# Altium schematic sheet Schem1_pwr5vReg.SchDoc
size A4
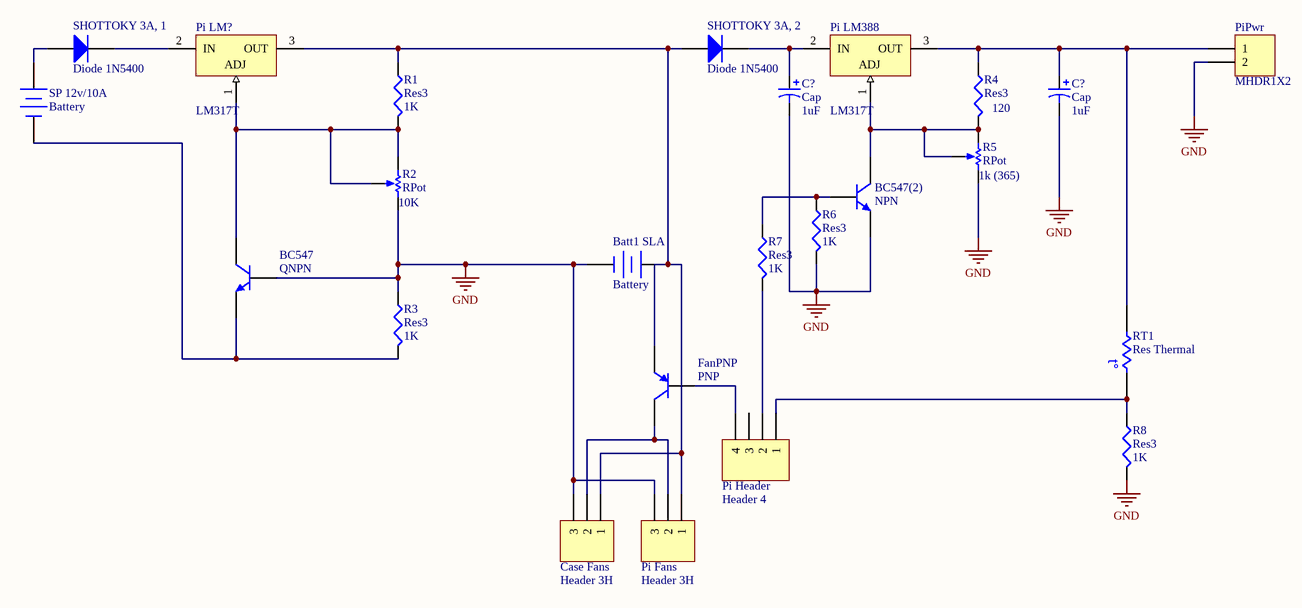
[diagram p0: Schem1_pwr5vReg.SchDoc]

## Parts
(Parts that share a designator on the sheet are numbered #1, #2 ... from top to bottom, then left to right.)
Batt1_SLA  Battery  [BAT-2]
BC547  QNPN  [SOT-23B_M]
BC547(2)  NPN  [TO-226-AA]
C?#1  Cap  value 1uF  [C0805]
C?#2  Cap  value 1uF  [C0805]
Case_Fans  Header 3H  [HDR1X3H]
FanPNP  PNP  [SOT-23B_N]
Pi_Fans  Header 3H  [HDR1X3H]
Pi_Header  Header 4  [HDR1X4]
Pi_LM388  LM317T  [TO220ABN]
Pi_LM?  LM317T  [TO220ABN]
PiPwr  MHDR1X2  [MHDR1X2]
R1  Res3  value 1K  [J1-0603]
R2  RPot  value 10K  [VR5]
R3  Res3  value 1K  [J1-0603]
R4  Res3  value 120  [J1-0603]
R5  RPot  value 1k (365)  [VR5]
R6  Res3  value 1K  [J1-0603]
R7  Res3  value 1K  [J1-0603]
R8  Res3  value 1K  [J1-0603]
RT1  Res Thermal  [6-0805_N]
SHOTTOKY_3A,_1  Diode 1N5400  [DO-201AD]
SHOTTOKY_3A,_2  Diode 1N5400  [DO-201AD]
SP_12v/10A  Battery  [BAT-2]

## Nets
GND: Batt1_SLA.2(-) BC547.2(B) BC547(2).3(E) C?#1.2 C?#2.2 Case_Fans.3 Pi_Fans.3 PiPwr.2 R2.2(BOT) R3.1 R5.2(BOT) R6.2 R8.2
NetBatt1_SLA_1: Batt1_SLA.1(+) Case_Fans.1 FanPNP.3(E) Pi_Fans.1 Pi_LM?.3(OUT) R1.1 SHOTTOKY_3A,_2.1(A)
NetBC547(2)_1: BC547(2).1(C) Pi_LM388.1(ADJ) R4.2 R5.1(TOP) R5.3(TAP)
NetBC547(2)_2: BC547(2).2(B) R6.1 R7.1
NetBC547_1: BC547.1(C) Pi_LM?.1(ADJ) R1.2 R2.1(TOP) R2.3(TAP)
NetBC547_3: BC547.3(E) R3.2 SP_12v/10A.2(-)
NetC?#1_1: C?#1.1 Pi_LM388.2(IN) SHOTTOKY_3A,_2.2(K)
NetC?#2_1: C?#2.1 Pi_LM388.3(OUT) PiPwr.1 R4.1 RT1.2
NetCase_Fans_2: Case_Fans.2 FanPNP.1(C) Pi_Fans.2
NetFanPNP_2: FanPNP.2(B) Pi_Header.4
NetPi_Header_1: Pi_Header.1 R8.1 RT1.1
NetPi_Header_2: Pi_Header.2 R7.2
NetPi_LM?_2: Pi_LM?.2(IN) SHOTTOKY_3A,_1.2(K)
NetSHOTTOKY_3A,_1_1: SHOTTOKY_3A,_1.1(A) SP_12v/10A.1(+)

Not connected (* = marked no-connect by the designer): Pi_Header 3

## Notes on the sheet
- (in symbol Res Thermal) t°

## Library data of the parts
Batt1_SLA SP_12v/10A = Battery: Multicell Battery; Published: 24-Mar-1999; LatestRevisionDate: 17-Jul-2002; LatestRevisionNote: Re-released for DXP Platform.; PackageReference: BAT-2; Publisher: Altium Limited; PackageDescription: Battery; 2 Leads
BC547 = QNPN: NPN Bipolar Transistor; Published: 8-Jun-2000; LatestRevisionDate: 29-May-2009; LatestRevisionNote: IPC-7351 Footprint Added.; PackageVersion: Aug-1999; PackageReference: SOT-23B; Publisher: Altium Limited; PackageDescription: 3-Pin SOT-23 Package 0.95 mm Pitch, 2.4 mm Lead Span
BC547(2) = NPN: NPN Bipolar Transistor; Published: 8-Jun-2000; LatestRevisionDate: 17-Jul-2002; LatestRevisionNote: Re-released for DXP Platform.; PackageReference: TO-226-AA; Publisher: Altium Limited; PackageDescription: TO, Flat Index; 3 In-Line, Axial Leads; Body Dia. 4.8mm; Leads 0.55 x 0.51 mm (max); Code_JEDEC: TO-226-AA
C?#1 C?#2 = Cap Pol3: Polarized Capacitor (Surface Mount); Published: 8-Jun-2000; LatestRevisionDate: 29-May-2009; LatestRevisionNote: IPC-7351 Footprint Added.; PackageReference: C0805; Publisher: Altium Limited; PackageDescription: Chip Capacitor
Case_Fans Pi_Fans = Header 3H: Header, 3-Pin, Right Angle; LatestRevisionDate: 17-Jul-2002; LatestRevisionNote: Re-released for DXP Platform.; Publisher: Altium Limited
FanPNP = PNP: PNP Bipolar Transistor; Published: 8-Jun-2000; LatestRevisionDate: 29-May-2009; LatestRevisionNote: IPC-7351 Footprint Added.; PackageVersion: Aug-1999; PackageReference: SOT-23B; Publisher: Altium Limited; PackageDescription: 3-Pin SOT-23 Package 0.95 mm Pitch, 2.4 mm Lead Span
Pi_Header = Header 4: Header, 4-Pin; LatestRevisionDate: 17-Jul-2002; LatestRevisionNote: Re-released for DXP Platform.; Publisher: Altium Limited
Pi_LM388 Pi_LM? = LM317T: 1.2V to 37V Voltage Regulator; Note: Tab is connected to pin 3 (OUT).; Published: 24-Aug-2001; LatestRevisionDate: 17-Jul-2002; LatestRevisionNote: Re-released for DXP Platform.; DatasheetVersion: Nov-1999; PackageVersion: Jun-1998; PackageReference: TO220ABN; Publisher: Altium Limited; PackageDescription: TO, Thru-Hole, Vertical, Heatsink Mounted; 3 In-Line Leads; Pitch 2.54 mm; Pin sequence 1, 3, 2; ComponentLink1Description: Manufacturer Link; ComponentLink1URL: http://www.st.com/; ComponentLink2Description: Datasheet; ComponentLink2URL: http://www.st.com/stonline/products/literature/ds/2154/lm117.pdf
PiPwr = MHDR1X2: Header, 2-Pin; LatestRevisionDate: 17-Jul-2002; LatestRevisionNote: Re-released for DXP Platform.; Publisher: Altium Limited
R1 R3 R4 R6-R8 = Res3: Resistor; Published: 8-Jun-2000; LatestRevisionDate: 29-May-2009; LatestRevisionNote: IPC-7351 Footprint Added.; PackageReference: J1-0603; Publisher: Altium Limited; PackageDescription: Chip Resistor
R2 R5 = RPot: Potentiometer; Sim Note: Enter the Resistance value and the set point into parameter fields.; Set Position: 0.5; Published: 8-Jun-2000; LatestRevisionDate: 17-Jul-2002; LatestRevisionNote: Re-released for DXP Platform.; PackageReference: VR5; Publisher: Altium Limited; PackageDescription: Variable Resistor, Thru-Hole; 3 Leads
RT1 = Res Thermal: Thermistor; Published: 24-Mar-1999; LatestRevisionDate: 29-May-2009; LatestRevisionNote: IPC-7351 Footprint Added.; PackageVersion: Mar-2003; PackageReference: 6-0805; Publisher: Altium Limited; PackageDescription: Chip Resistor 0805 Case Size; Code_IPC: RESC2012
SHOTTOKY_3A,_1 SHOTTOKY_3A,_2 = Diode 1N5400: 3 Amp General Purpose Rectifier; Published: 8-Jun-2000; LatestRevisionDate: 17-Jul-2002; LatestRevisionNote: Re-released for DXP Platform.; DatasheetVersion: 1998; PackageVersion: Aug-1999; PackageReference: DO-201AD; Publisher: Altium Limited; PackageDescription: Diode, Axial; Body 9.5 x 5.6 mm (LxDia. max), Lead Dia. 1.32 mm (max); ComponentLink1Description: Manufacturer Link; ComponentLink1URL: http://www.fairchildsemi.com/; ComponentLink2Description: Datasheet; ComponentLink2URL: http://www.fairchildsemi.com/ds/1N%2F1N5400.pdf